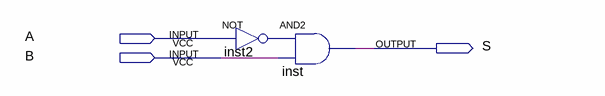
[diagram p0: schematic sheet]
// Quartus schematic MenorQue.bdf as structural Verilog: 2 symbols, 3 pins
module MenorQue (
  input  A,
  input  B,
  output S
);

  wire inst2_out;

  not inst2 (inst2_out, A);
  and inst (S, inst2_out, B);
endmodule
